# Altium schematic sheet RK3399_EMMC_ADC_PCIE.SchDoc
size A4; SheetNumber: 7; SheetTotal: 20
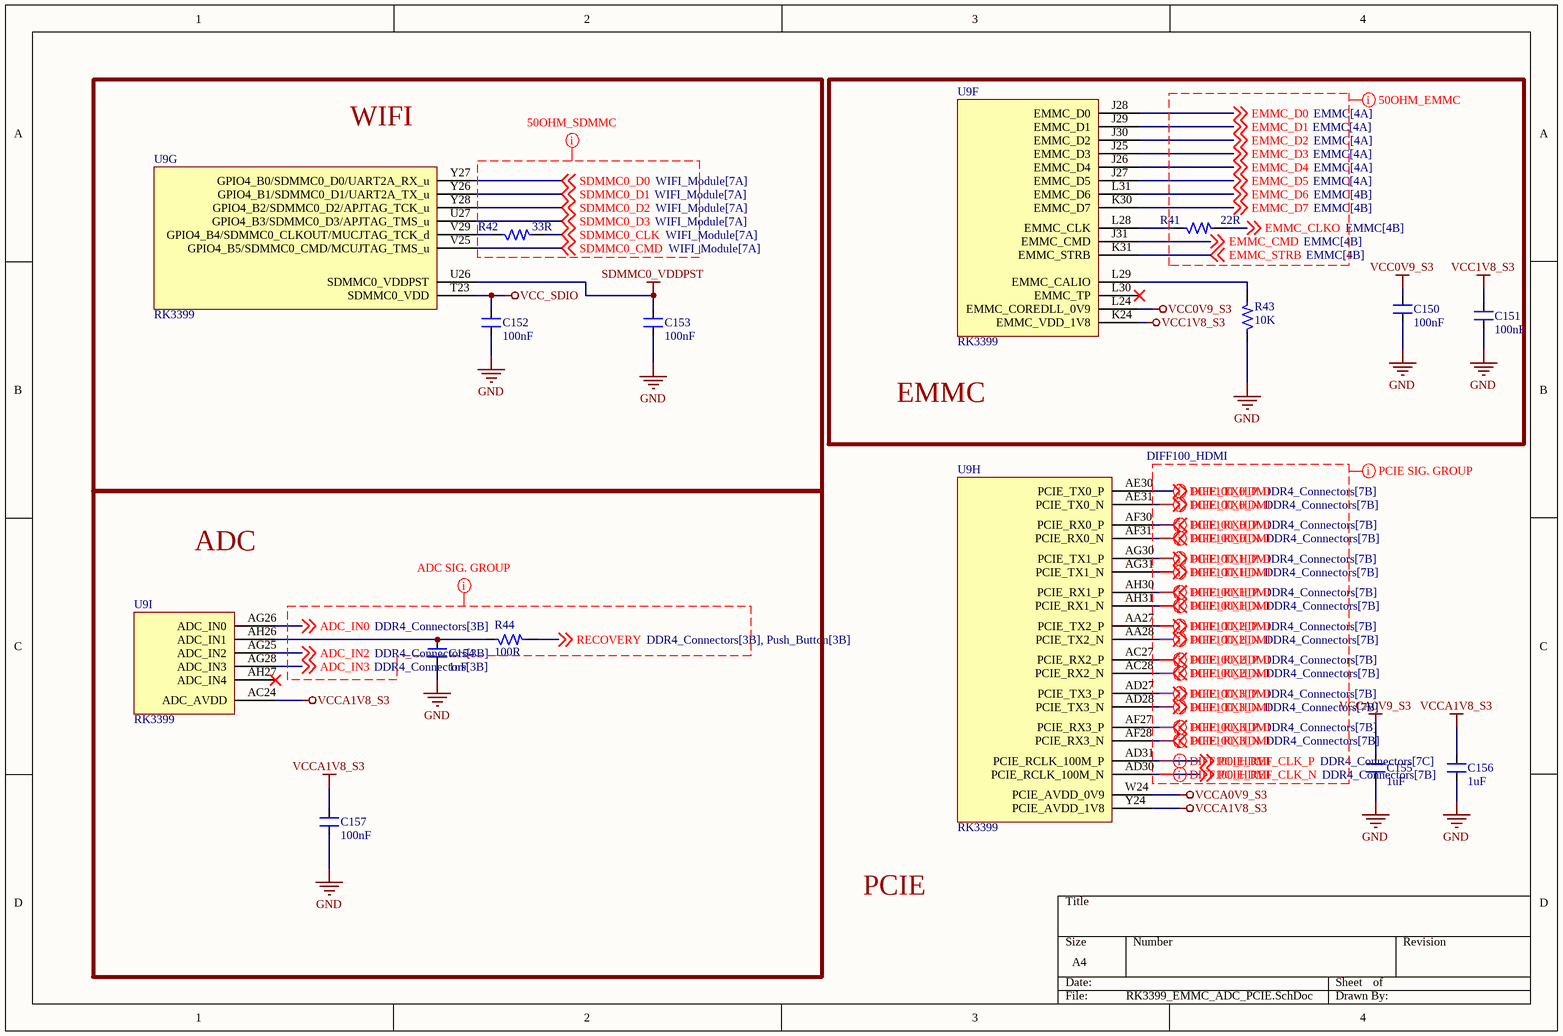
[diagram p0: RK3399_EMMC_ADC_PCIE.SchDoc]

## Parts
C150  100nF  [CAP_0201]
C151  100nF  [CAP_0201]
C152  100nF  [CAP_0201]
C153  100nF  [CAP_0201]
C154  1nF  [CAP_0201]
C155  1uF  [CAP_0201]
C156  1uF  [CAP_0201]
C157  100nF  [CAP_0201]
R41  22R  [RES_0201]
R42  33R  [RES_0201]
R43  10K  [RES_0201]
R44  100R  [RES_0201]
U9  RK3399  [FBGA828_23_826X826]  (parts F,G,H,I of 24)

## Blocks framed on the sheet
WIFI: C152 C153 R42 U9
EMMC: C150 C151 R41 R43 U9
ADC: C154 C157 R44 U9

## Nets
GND: C150.1 C151.1 C152.1 C153.1 C154.1 C155.1 C156.1 C157.1 R43.1
SDMMC0_VDDPST: C153.2 U9.U26(SDMMC0_VDDPST)
VCC0V9_S3: C150.2 U9.L24(EMMC_COREDLL_0V9)
VCC1V8_S3: C151.2 U9.K24(EMMC_VDD_1V8)
VCC_SDIO: C152.2 U9.T23(SDMMC0_VDD)
VCCA0V9_S3: C155.2 U9.W24(PCIE_AVDD_0V9)
VCCA1V8_S3: C156.2 C157.2 U9.AC24(ADC_AVDD) U9.Y24(PCIE_AVDD_1V8)
ADC_IN0: U9.AG26(ADC_IN0) ; off-sheet ADC_IN0
ADC_IN2: U9.AG25(ADC_IN2) ; off-sheet ADC_IN2
ADC_IN3: U9.AG28(ADC_IN3) ; off-sheet ADC_IN3
EMMC_CLKO: R41.2 ; off-sheet EMMC_CLKO
EMMC_CMD: U9.J31(EMMC_CMD) ; off-sheet EMMC_CMD
EMMC_D0: U9.J28(EMMC_D0) ; off-sheet EMMC_D0
EMMC_D1: U9.J29(EMMC_D1) ; off-sheet EMMC_D1
EMMC_D2: U9.J30(EMMC_D2) ; off-sheet EMMC_D2
EMMC_D3: U9.J25(EMMC_D3) ; off-sheet EMMC_D3
EMMC_D4: U9.J26(EMMC_D4) ; off-sheet EMMC_D4
EMMC_D5: U9.J27(EMMC_D5) ; off-sheet EMMC_D5
EMMC_D6: U9.L31(EMMC_D6) ; off-sheet EMMC_D6
EMMC_D7: U9.K30(EMMC_D7) ; off-sheet EMMC_D7
EMMC_STRB: U9.K31(EMMC_STRB) ; off-sheet EMMC_STRB
PCIE_REF_CLK_N: U9.AD30(PCIE_RCLK_100M_N) ; off-sheet PCIE_REF_CLK_N
PCIE_REF_CLK_P: U9.AD31(PCIE_RCLK_100M_P) ; off-sheet PCIE_REF_CLK_P
PCIE_RX0_N: U9.AF31(PCIE_RX0_N) ; off-sheet PCIE_RX0_N
PCIE_RX0_P: U9.AF30(PCIE_RX0_P) ; off-sheet PCIE_RX0_P
PCIE_RX1_N: U9.AH31(PCIE_RX1_N) ; off-sheet PCIE_RX1_N
PCIE_RX1_P: U9.AH30(PCIE_RX1_P) ; off-sheet PCIE_RX1_P
PCIE_RX2_N: U9.AC28(PCIE_RX2_N) ; off-sheet PCIE_RX2_N
PCIE_RX2_P: U9.AC27(PCIE_RX2_P) ; off-sheet PCIE_RX2_P
PCIE_RX3_N: U9.AF28(PCIE_RX3_N) ; off-sheet PCIE_RX3_N
PCIE_RX3_P: U9.AF27(PCIE_RX3_P) ; off-sheet PCIE_RX3_P
PCIE_TX0_N: U9.AE31(PCIE_TX0_N) ; off-sheet PCIE_TX0_N
PCIE_TX0_P: U9.AE30(PCIE_TX0_P) ; off-sheet PCIE_TX0_P
PCIE_TX1_N: U9.AG31(PCIE_TX1_N) ; off-sheet PCIE_TX1_N
PCIE_TX1_P: U9.AG30(PCIE_TX1_P) ; off-sheet PCIE_TX1_P
PCIE_TX2_N: U9.AA28(PCIE_TX2_N) ; off-sheet PCIE_TX2_N
PCIE_TX2_P: U9.AA27(PCIE_TX2_P) ; off-sheet PCIE_TX2_P
PCIE_TX3_N: U9.AD28(PCIE_TX3_N) ; off-sheet PCIE_TX3_N
PCIE_TX3_P: U9.AD27(PCIE_TX3_P) ; off-sheet PCIE_TX3_P
RECOVERY: R44.2 ; off-sheet RECOVERY
SDMMC0_CLK: R42.2 ; off-sheet SDMMC0_CLK
SDMMC0_CMD: U9.V25(GPIO4_B5/SDMMC0_CMD/MCUJTAG_TMS_u) ; off-sheet SDMMC0_CMD
SDMMC0_D0: U9.Y27(GPIO4_B0/SDMMC0_D0/UART2A_RX_u) ; off-sheet SDMMC0_D0
SDMMC0_D1: U9.Y26(GPIO4_B1/SDMMC0_D1/UART2A_TX_u) ; off-sheet SDMMC0_D1
SDMMC0_D2: U9.Y28(GPIO4_B2/SDMMC0_D2/APJTAG_TCK_u) ; off-sheet SDMMC0_D2
SDMMC0_D3: U9.U27(GPIO4_B3/SDMMC0_D3/APJTAG_TMS_u) ; off-sheet SDMMC0_D3
NetC154_2: C154.2 R44.1 U9.AH26(ADC_IN1)
NetR41_1: R41.1 U9.L28(EMMC_CLK)
NetR42_1: R42.1 U9.V29(GPIO4_B4/SDMMC0_CLKOUT/MUCJTAG_TCK_d)
NetR43_2: R43.2 U9.L29(EMMC_CALIO)

Not connected (* = marked no-connect by the designer): U9 AH27(ADC_IN4)* L30(EMMC_TP)*

## Layout directives
net class 50OHM_SDMMC: SDMMC0_CLK, SDMMC0_CMD, SDMMC0_D0, SDMMC0_D1, SDMMC0_D2, SDMMC0_D3
net class ADC SIG. GROUP: ADC_IN0, ADC_IN2, ADC_IN3, RECOVERY
net class 50OHM_EMMC: EMMC_CLKO, EMMC_CMD, EMMC_D0, EMMC_D1, EMMC_D2, EMMC_D3, EMMC_D4, EMMC_D5, EMMC_D6, EMMC_D7, EMMC_STRB
differential pair; differential pair class DIFF100_HDMI: PCIE_REF_CLK_N, PCIE_REF_CLK_P, PCIE_RX0_N, PCIE_RX0_P, PCIE_RX1_N, PCIE_RX1_P, PCIE_RX2_N, PCIE_RX2_P, PCIE_RX3_N, PCIE_RX3_P, PCIE_TX0_N, PCIE_TX0_P, PCIE_TX1_N, PCIE_TX1_P, PCIE_TX2_N, PCIE_TX2_P, PCIE_TX3_N, PCIE_TX3_P
net class PCIE SIG. GROUP: PCIE_REF_CLK_N, PCIE_REF_CLK_P, PCIE_RX0_N, PCIE_RX0_P, PCIE_RX1_N, PCIE_RX1_P, PCIE_RX2_N, PCIE_RX2_P, PCIE_RX3_N, PCIE_RX3_P, PCIE_TX0_N, PCIE_TX0_P, PCIE_TX1_N, PCIE_TX1_P, PCIE_TX2_N, PCIE_TX2_P, PCIE_TX3_N, PCIE_TX3_P

## Notes on the sheet
- PCIE

## Library data of the parts
C150-C153 C157 = CAP_100nF-25V-10%-0201: 0.1µF ±10% 25V Ceramic Capacitor X5R 0201 (0603 Metric); Manufacturer: TDK Corporation; Manufacturer Part Number: C0603X5R1E104K030BB; Case/Package: 0201; Supplier-1: Digikey
C154 = CAP_1nF-16V-10%-0201: 1000pF ±10% 16V Ceramic Capacitor X7R 0201 (0603 Metric); Manufacturer: Murata Electronics; Manufacturer Part Number: GRM033R71C102KA01D; Case/Package: 0201; Supplier-1: Digikey
C155 C156 = CAP_1uF-16V-10%-0201: 1µF ±20% 16V Ceramic Capacitor X5R 0201 (0603 Metric); Manufacturer: Samsung Electro-Mechanics; Manufacturer Part Number: CL03A105MO3NRNH; Case/Package: 0201; Supplier-1: Digikey
R41 = RES_22R-0.05W-1%-0201: 22 Ohms ±1% 0.05W, 1/20W Chip Resistor 0201 (0603 Metric) Moisture Resistant Thick Film; Manufacturer: Yageo; Manufacturer Part Number: RC0201FR-0722RL; Case/Package: 0201; Supplier-1: Digikey
R42 = RES_33R-0.05W-1%-0201: 33 Ohms ±1% 0.05W, 1/20W Chip Resistor 0201 (0603 Metric) Thick Film; Manufacturer: Yageo; Manufacturer Part Number: RC0201FR-0733RL; Case/Package: 0201; Supplier-1: Digikey
R43 = RES_10K-0.05W-1%-0201: 10 kOhms ±1% 0.05W, 1/20W Chip Resistor 0201 (0603 Metric) Thick Film; Manufacturer: Stackpole Electronics Inc; Manufacturer Part Number: RMCF0201FT10K0; Case/Package: 0201; Supplier-1: Digikey
R44 = RES_100R-0.05W-1%-0201: 100 kOhms ±1% 0.05W, 1/20W Chip Resistor 0201 (0603 Metric) Automotive AEC-Q200 Thick Film; Manufacturer: Panasonic Electronic Components; Manufacturer Part Number: ERJ-1GNF1003C; Case/Package: 0201; Supplier-1: Digikey
U9 = IC_RK3399-FCBGA828: RK3399 is a low power, high performance processor for computing, personal mobile.; Manufacturer: Rockchip; Manufacturer Part Number: RK3399; Case/Package: FCBGA828; Supplier-1: Rockchip